# Altium schematic sheet Core.SchDoc: Title
size A3; Date: Date; CompanyName: Integrated Micro-Electronics Bulgaria; Organization: Design & Development Department; Address1: Drawing Type; Address2: Address 1; Address3: Address 2; Address4: Address 3; DocumentNumber: 730xxx; Revision: 01; SheetNumber: 1; SheetTotal: 1; PageSetup: Record=PageOptions|CenterHorizontal=True|CenterVertical=True|PrintScale=0.70|XCorrection=1.00|YCorrection=1.00|PrintKind=2|BorderSize=5000000|LeftOffset=0|BottomOffset=0|Orientation=2|PaperLength=1000|PaperWidth=1000|Scale=100|PaperSource=7|PrintQuality=-4|MediaType=1|DitherType=10|PaperKind=A4|PrintScaleMode=1; SheetSize: A3; Time: Time; ModifiedDate: Mod. Date
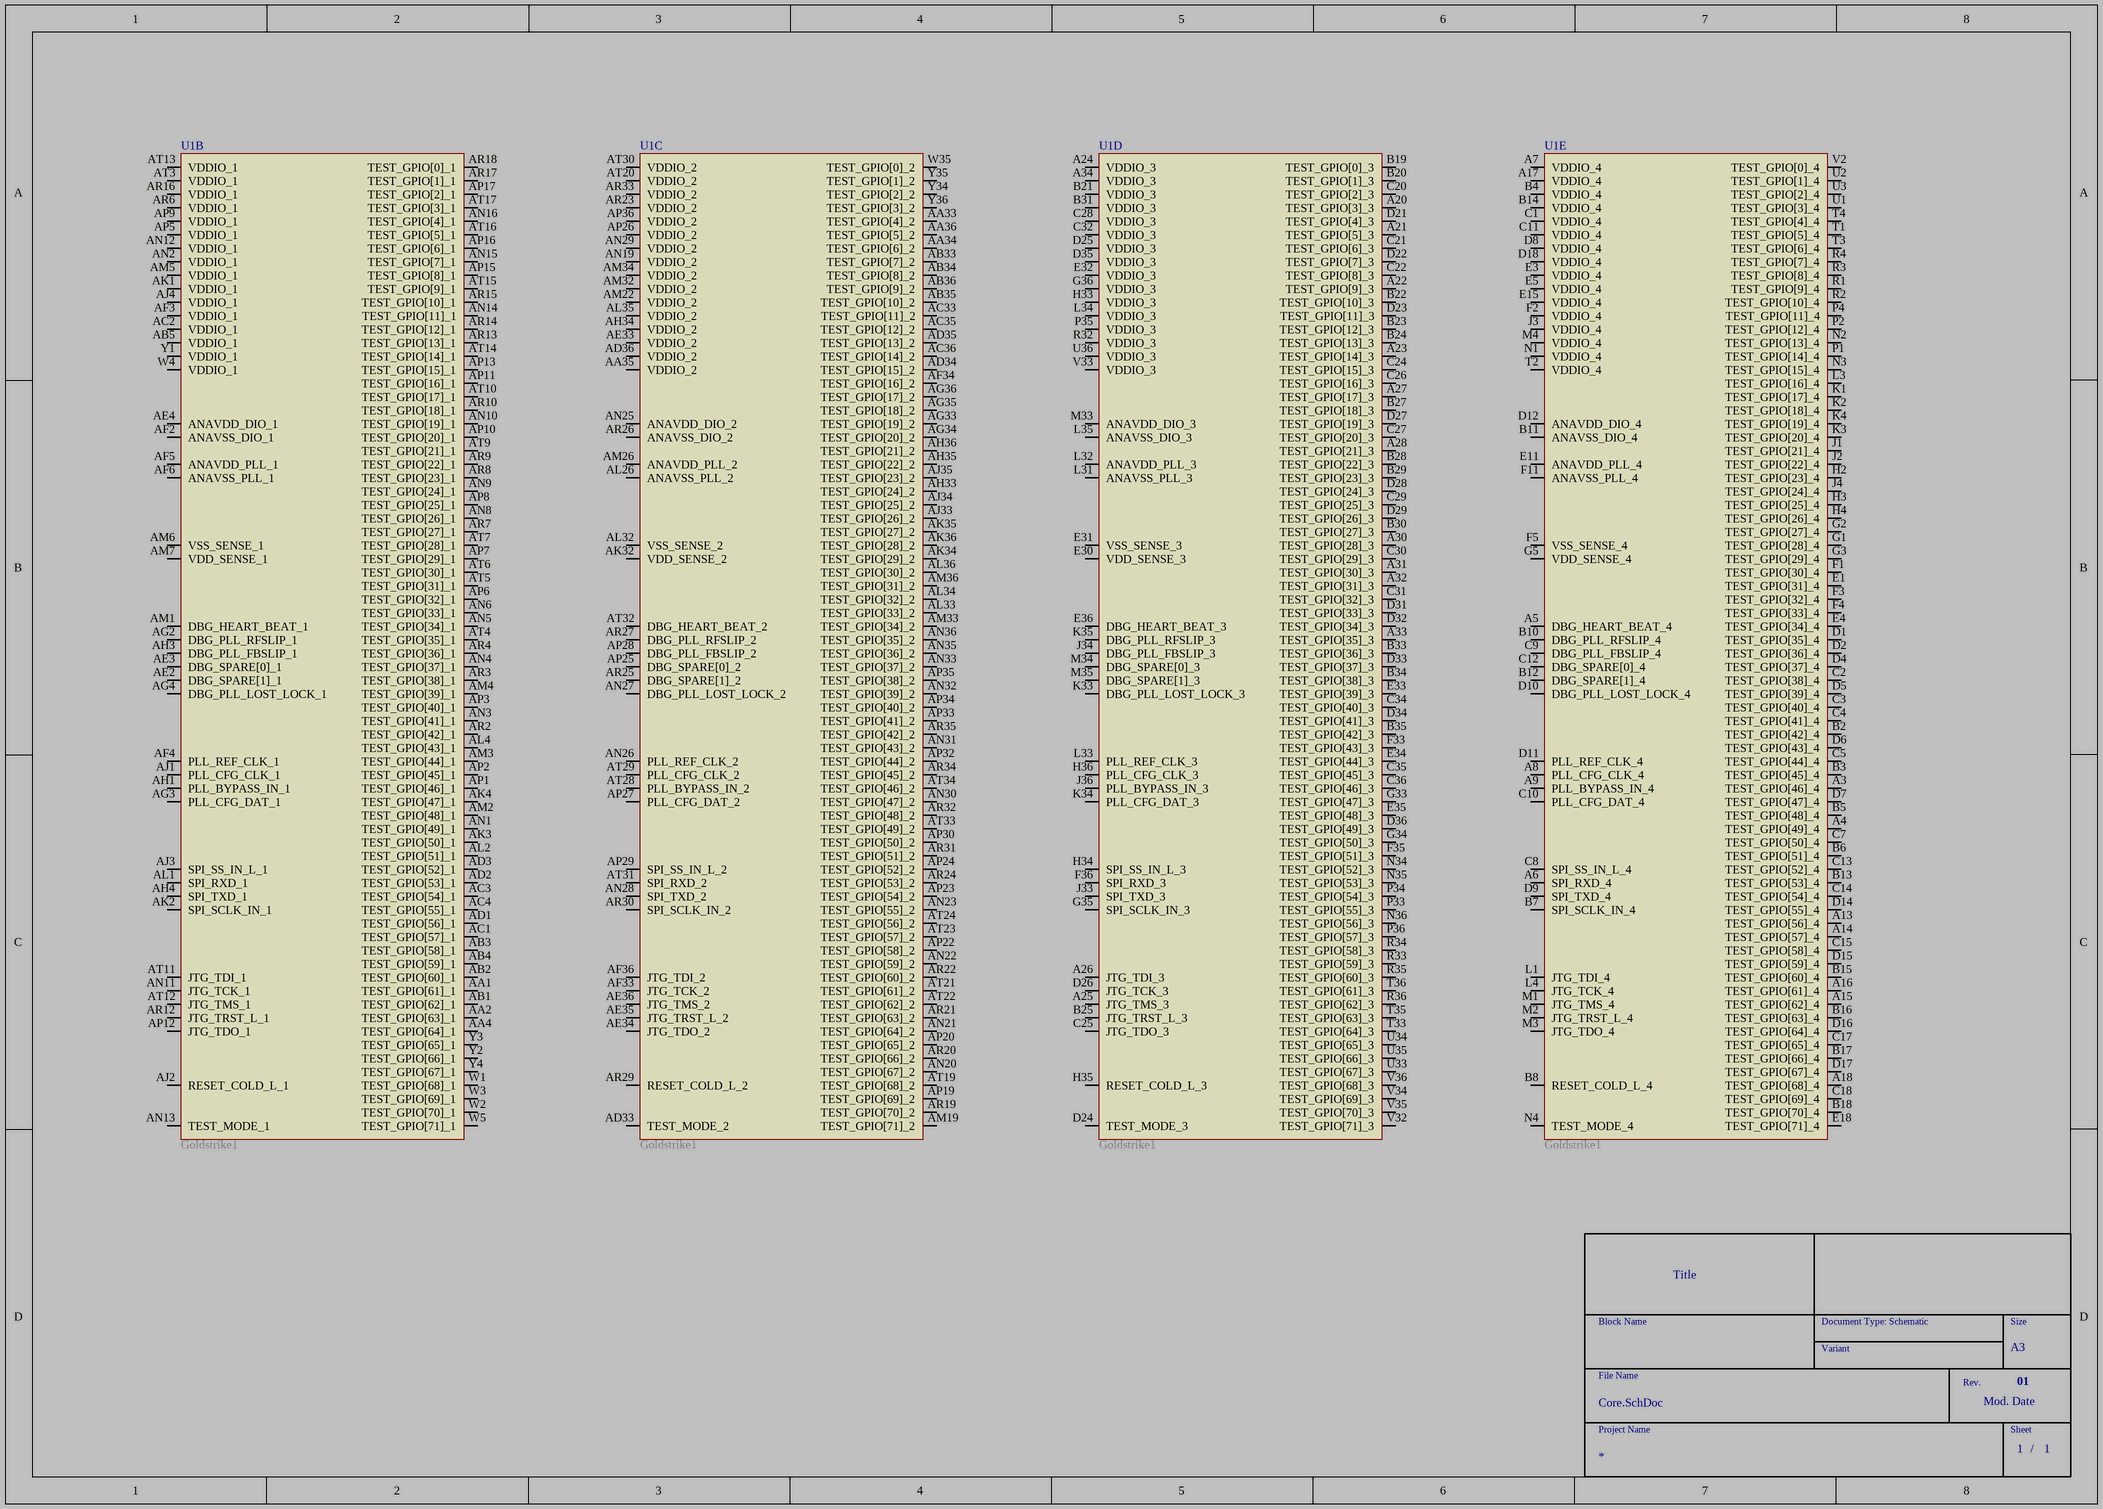
[diagram p0: Core.SchDoc]

## Parts
U1  Goldstrike1  (parts B,C,D,E of 5)

## Nets

Not connected (* = marked no-connect by the designer): U1 A3(TEST_GPIO[46]_4) A4(TEST_GPIO[49]_4) A5(DBG_HEART_BEAT_4) A6(SPI_RXD_4) A7(VDDIO_4) A8(PLL_CFG_CLK_4) A9(PLL_BYPASS_IN_4) A13(TEST_GPIO[56]_4) A14(TEST_GPIO[57]_4) A15(TEST_GPIO[62]_4) A16(TEST_GPIO[61]_4) A17(VDDIO_4) A18(TEST_GPIO[68]_4) A20(TEST_GPIO[3]_3) A21(TEST_GPIO[5]_3) A22(TEST_GPIO[9]_3) A23(TEST_GPIO[14]_3) A24(VDDIO_3) A25(JTG_TMS_3) A26(JTG_TDI_3) A27(TEST_GPIO[17]_3) A28(TEST_GPIO[21]_3) A30(TEST_GPIO[28]_3) A31(TEST_GPIO[30]_3) A32(TEST_GPIO[31]_3) A33(TEST_GPIO[35]_3) A34(VDDIO_3) AA1(TEST_GPIO[61]_1) AA2(TEST_GPIO[63]_1) AA4(TEST_GPIO[64]_1) AA33(TEST_GPIO[4]_2) AA34(TEST_GPIO[6]_2) AA35(VDDIO_2) AA36(TEST_GPIO[5]_2) AB1(TEST_GPIO[62]_1) AB2(TEST_GPIO[60]_1) AB3(TEST_GPIO[58]_1) AB4(TEST_GPIO[59]_1) AB5(VDDIO_1) AB33(TEST_GPIO[7]_2) AB34(TEST_GPIO[8]_2) AB35(TEST_GPIO[10]_2) AB36(TEST_GPIO[9]_2) AC1(TEST_GPIO[57]_1) AC2(VDDIO_1) AC3(TEST_GPIO[54]_1) AC4(TEST_GPIO[55]_1) AC33(TEST_GPIO[11]_2) AC35(TEST_GPIO[12]_2) AC36(TEST_GPIO[14]_2) AD1(TEST_GPIO[56]_1) AD2(TEST_GPIO[53]_1) AD3(TEST_GPIO[52]_1) AD33(TEST_MODE_2) AD34(TEST_GPIO[15]_2) AD35(TEST_GPIO[13]_2) AD36(VDDIO_2) AE2(DBG_SPARE[1]_1) AE3(DBG_SPARE[0]_1) AE4(ANAVDD_DIO_1) AE33(VDDIO_2) AE34(JTG_TDO_2) AE35(JTG_TRST_L_2) AE36(JTG_TMS_2) AF2(ANAVSS_DIO_1) AF3(VDDIO_1) AF4(PLL_REF_CLK_1) AF5(ANAVDD_PLL_1) AF6(ANAVSS_PLL_1) AF33(JTG_TCK_2) AF34(TEST_GPIO[16]_2) AF36(JTG_TDI_2) AG2(DBG_PLL_RFSLIP_1) AG3(PLL_CFG_DAT_1) AG4(DBG_PLL_LOST_LOCK_1) AG33(TEST_GPIO[19]_2) AG34(TEST_GPIO[20]_2) AG35(TEST_GPIO[18]_2) AG36(TEST_GPIO[17]_2) AH1(PLL_BYPASS_IN_1) AH3(DBG_PLL_FBSLIP_1) AH4(SPI_TXD_1) AH33(TEST_GPIO[24]_2) AH34(VDDIO_2) AH35(TEST_GPIO[22]_2) AH36(TEST_GPIO[21]_2) AJ1(PLL_CFG_CLK_1) AJ2(RESET_COLD_L_1) AJ3(SPI_SS_IN_L_1) AJ4(VDDIO_1) AJ33(TEST_GPIO[26]_2) AJ34(TEST_GPIO[25]_2) AJ35(TEST_GPIO[23]_2) AK1(VDDIO_1) AK2(SPI_SCLK_IN_1) AK3(TEST_GPIO[50]_1) AK4(TEST_GPIO[47]_1) AK32(VDD_SENSE_2) AK34(TEST_GPIO[29]_2) AK35(TEST_GPIO[27]_2) AK36(TEST_GPIO[28]_2) AL1(SPI_RXD_1) AL2(TEST_GPIO[51]_1) AL4(TEST_GPIO[43]_1) AL26(ANAVSS_PLL_2) AL32(VSS_SENSE_2) AL33(TEST_GPIO[33]_2) AL34(TEST_GPIO[32]_2) AL35(VDDIO_2) AL36(TEST_GPIO[30]_2) AM1(DBG_HEART_BEAT_1) AM2(TEST_GPIO[48]_1) AM3(TEST_GPIO[44]_1) AM4(TEST_GPIO[39]_1) AM5(VDDIO_1) AM6(VSS_SENSE_1) AM7(VDD_SENSE_1) AM19(TEST_GPIO[71]_2) AM22(VDDIO_2) AM26(ANAVDD_PLL_2) AM32(VDDIO_2) AM33(TEST_GPIO[34]_2) AM34(VDDIO_2) AM36(TEST_GPIO[31]_2) AN1(TEST_GPIO[49]_1) AN2(VDDIO_1) AN3(TEST_GPIO[41]_1) AN4(TEST_GPIO[37]_1) AN5(TEST_GPIO[34]_1) AN6(TEST_GPIO[33]_1) AN8(TEST_GPIO[26]_1) AN9(TEST_GPIO[24]_1) AN10(TEST_GPIO[19]_1) AN11(JTG_TCK_1) AN12(VDDIO_1) AN13(TEST_MODE_1) AN14(TEST_GPIO[11]_1) AN15(TEST_GPIO[7]_1) AN16(TEST_GPIO[4]_1) AN19(VDDIO_2) AN20(TEST_GPIO[67]_2) AN21(TEST_GPIO[64]_2) AN22(TEST_GPIO[59]_2) AN23(TEST_GPIO[55]_2) AN25(ANAVDD_DIO_2) AN26(PLL_REF_CLK_2) AN27(DBG_PLL_LOST_LOCK_2) AN28(SPI_TXD_2) AN29(VDDIO_2) AN30(TEST_GPIO[47]_2) AN31(TEST_GPIO[43]_2) AN32(TEST_GPIO[39]_2) AN33(TEST_GPIO[37]_2) AN35(TEST_GPIO[36]_2) AN36(TEST_GPIO[35]_2) AP1(TEST_GPIO[46]_1) AP2(TEST_GPIO[45]_1) AP3(TEST_GPIO[40]_1) AP5(VDDIO_1) AP6(TEST_GPIO[32]_1) AP7(TEST_GPIO[29]_1) AP8(TEST_GPIO[25]_1) AP9(VDDIO_1) AP10(TEST_GPIO[20]_1) AP11(TEST_GPIO[16]_1) AP12(JTG_TDO_1) AP13(TEST_GPIO[15]_1) AP15(TEST_GPIO[8]_1) AP16(TEST_GPIO[6]_1) AP17(TEST_GPIO[2]_1) AP19(TEST_GPIO[69]_2) AP20(TEST_GPIO[65]_2) AP22(TEST_GPIO[58]_2) AP23(TEST_GPIO[54]_2) AP24(TEST_GPIO[52]_2) AP25(DBG_SPARE[0]_2) AP26(VDDIO_2) AP27(PLL_CFG_DAT_2) AP28(DBG_PLL_FBSLIP_2) AP29(SPI_SS_IN_L_2) AP30(TEST_GPIO[50]_2) AP32(TEST_GPIO[44]_2) AP33(TEST_GPIO[41]_2) AP34(TEST_GPIO[40]_2) AP35(TEST_GPIO[38]_2) AP36(VDDIO_2) AR2(TEST_GPIO[42]_1) AR3(TEST_GPIO[38]_1) AR4(TEST_GPIO[36]_1) AR6(VDDIO_1) AR7(TEST_GPIO[27]_1) AR8(TEST_GPIO[23]_1) AR9(TEST_GPIO[22]_1) AR10(TEST_GPIO[18]_1) AR12(JTG_TRST_L_1) AR13(TEST_GPIO[13]_1) AR14(TEST_GPIO[12]_1) AR15(TEST_GPIO[10]_1) AR16(VDDIO_1) AR17(TEST_GPIO[1]_1) AR18(TEST_GPIO[0]_1) AR19(TEST_GPIO[70]_2) AR20(TEST_GPIO[66]_2) AR21(TEST_GPIO[63]_2) AR22(TEST_GPIO[60]_2) AR23(VDDIO_2) AR24(TEST_GPIO[53]_2) AR25(DBG_SPARE[1]_2) AR26(ANAVSS_DIO_2) AR27(DBG_PLL_RFSLIP_2) AR29(RESET_COLD_L_2) AR30(SPI_SCLK_IN_2) AR31(TEST_GPIO[51]_2) AR32(TEST_GPIO[48]_2) AR33(VDDIO_2) AR34(TEST_GPIO[45]_2) AR35(TEST_GPIO[42]_2) AT3(VDDIO_1) AT4(TEST_GPIO[35]_1) AT5(TEST_GPIO[31]_1) AT6(TEST_GPIO[30]_1) AT7(TEST_GPIO[28]_1) AT9(TEST_GPIO[21]_1) AT10(TEST_GPIO[17]_1) AT11(JTG_TDI_1) AT12(JTG_TMS_1) AT13(VDDIO_1) AT14(TEST_GPIO[14]_1) AT15(TEST_GPIO[9]_1) AT16(TEST_GPIO[5]_1) AT17(TEST_GPIO[3]_1) AT19(TEST_GPIO[68]_2) AT20(VDDIO_2) AT21(TEST_GPIO[61]_2) AT22(TEST_GPIO[62]_2) AT23(TEST_GPIO[57]_2) AT24(TEST_GPIO[56]_2) AT28(PLL_BYPASS_IN_2) AT29(PLL_CFG_CLK_2) AT30(VDDIO_2) AT31(SPI_RXD_2) AT32(DBG_HEART_BEAT_2) AT33(TEST_GPIO[49]_2) AT34(TEST_GPIO[46]_2) B2(TEST_GPIO[42]_4) B3(TEST_GPIO[45]_4) B4(VDDIO_4) B5(TEST_GPIO[48]_4) B6(TEST_GPIO[51]_4) B7(SPI_SCLK_IN_4) B8(RESET_COLD_L_4) B10(DBG_PLL_RFSLIP_4) B11(ANAVSS_DIO_4) B12(DBG_SPARE[1]_4) B13(TEST_GPIO[53]_4) B14(VDDIO_4) B15(TEST_GPIO[60]_4) B16(TEST_GPIO[63]_4) B17(TEST_GPIO[66]_4) B18(TEST_GPIO[70]_4) B19(TEST_GPIO[0]_3) B20(TEST_GPIO[1]_3) B21(VDDIO_3) B22(TEST_GPIO[10]_3) B23(TEST_GPIO[12]_3) B24(TEST_GPIO[13]_3) B25(JTG_TRST_L_3) B27(TEST_GPIO[18]_3) B28(TEST_GPIO[22]_3) B29(TEST_GPIO[23]_3) B30(TEST_GPIO[27]_3) B31(VDDIO_3) B33(TEST_GPIO[36]_3) B34(TEST_GPIO[38]_3) B35(TEST_GPIO[42]_3) C1(VDDIO_4) C2(TEST_GPIO[38]_4) C3(TEST_GPIO[40]_4) C4(TEST_GPIO[41]_4) C5(TEST_GPIO[44]_4) C7(TEST_GPIO[50]_4) C8(SPI_SS_IN_L_4) C9(DBG_PLL_FBSLIP_4) C10(PLL_CFG_DAT_4) C11(VDDIO_4) C12(DBG_SPARE[0]_4) C13(TEST_GPIO[52]_4) C14(TEST_GPIO[54]_4) C15(TEST_GPIO[58]_4) C17(TEST_GPIO[65]_4) C18(TEST_GPIO[69]_4) C20(TEST_GPIO[2]_3) C21(TEST_GPIO[6]_3) C22(TEST_GPIO[8]_3) C24(TEST_GPIO[15]_3) C25(JTG_TDO_3) C26(TEST_GPIO[16]_3) C27(TEST_GPIO[20]_3) C28(VDDIO_3) C29(TEST_GPIO[25]_3) C30(TEST_GPIO[29]_3) C31(TEST_GPIO[32]_3) C32(VDDIO_3) C34(TEST_GPIO[40]_3) C35(TEST_GPIO[45]_3) C36(TEST_GPIO[46]_3) D1(TEST_GPIO[35]_4) D2(TEST_GPIO[36]_4) D4(TEST_GPIO[37]_4) D5(TEST_GPIO[39]_4) D6(TEST_GPIO[43]_4) D7(TEST_GPIO[47]_4) D8(VDDIO_4) D9(SPI_TXD_4) D10(DBG_PLL_LOST_LOCK_4) D11(PLL_REF_CLK_4) D12(ANAVDD_DIO_4) D14(TEST_GPIO[55]_4) D15(TEST_GPIO[59]_4) D16(TEST_GPIO[64]_4) D17(TEST_GPIO[67]_4) D18(VDDIO_4) D21(TEST_GPIO[4]_3) D22(TEST_GPIO[7]_3) D23(TEST_GPIO[11]_3) D24(TEST_MODE_3) D25(VDDIO_3) D26(JTG_TCK_3) D27(TEST_GPIO[19]_3) D28(TEST_GPIO[24]_3) D29(TEST_GPIO[26]_3) D31(TEST_GPIO[33]_3) D32(TEST_GPIO[34]_3) D33(TEST_GPIO[37]_3) D34(TEST_GPIO[41]_3) D35(VDDIO_3) D36(TEST_GPIO[49]_3) E1(TEST_GPIO[31]_4) E3(VDDIO_4) E4(TEST_GPIO[34]_4) E5(VDDIO_4) E11(ANAVDD_PLL_4) E15(VDDIO_4) E18(TEST_GPIO[71]_4) E30(VDD_SENSE_3) E31(VSS_SENSE_3) E32(VDDIO_3) E33(TEST_GPIO[39]_3) E34(TEST_GPIO[44]_3) E35(TEST_GPIO[48]_3) E36(DBG_HEART_BEAT_3) F1(TEST_GPIO[30]_4) F2(VDDIO_4) F3(TEST_GPIO[32]_4) F4(TEST_GPIO[33]_4) F5(VSS_SENSE_4) F11(ANAVSS_PLL_4) F33(TEST_GPIO[43]_3) F35(TEST_GPIO[51]_3) F36(SPI_RXD_3) G1(TEST_GPIO[28]_4) G2(TEST_GPIO[27]_4) G3(TEST_GPIO[29]_4) G5(VDD_SENSE_4) G33(TEST_GPIO[47]_3) G34(TEST_GPIO[50]_3) G35(SPI_SCLK_IN_3) G36(VDDIO_3) H2(TEST_GPIO[23]_4) H3(TEST_GPIO[25]_4) H4(TEST_GPIO[26]_4) H33(VDDIO_3) H34(SPI_SS_IN_L_3) H35(RESET_COLD_L_3) H36(PLL_CFG_CLK_3) J1(TEST_GPIO[21]_4) J2(TEST_GPIO[22]_4) J3(VDDIO_4) J4(TEST_GPIO[24]_4) J33(SPI_TXD_3) J34(DBG_PLL_FBSLIP_3) J36(PLL_BYPASS_IN_3) K1(TEST_GPIO[17]_4) K2(TEST_GPIO[18]_4) K3(TEST_GPIO[20]_4) K4(TEST_GPIO[19]_4) K33(DBG_PLL_LOST_LOCK_3) K34(PLL_CFG_DAT_3) K35(DBG_PLL_RFSLIP_3) L1(JTG_TDI_4) L3(TEST_GPIO[16]_4) L4(JTG_TCK_4) L31(ANAVSS_PLL_3) L32(ANAVDD_PLL_3) L33(PLL_REF_CLK_3) L34(VDDIO_3) L35(ANAVSS_DIO_3) M1(JTG_TMS_4) M2(JTG_TRST_L_4) M3(JTG_TDO_4) M4(VDDIO_4) M33(ANAVDD_DIO_3) M34(DBG_SPARE[0]_3) M35(DBG_SPARE[1]_3) N1(VDDIO_4) N2(TEST_GPIO[13]_4) N3(TEST_GPIO[15]_4) N4(TEST_MODE_4) N34(TEST_GPIO[52]_3) N35(TEST_GPIO[53]_3) N36(TEST_GPIO[56]_3) P1(TEST_GPIO[14]_4) P2(TEST_GPIO[12]_4) P4(TEST_GPIO[11]_4) P33(TEST_GPIO[55]_3) P34(TEST_GPIO[54]_3) P35(VDDIO_3) P36(TEST_GPIO[57]_3) R1(TEST_GPIO[9]_4) R2(TEST_GPIO[10]_4) R3(TEST_GPIO[8]_4) R4(TEST_GPIO[7]_4) R32(VDDIO_3) R33(TEST_GPIO[59]_3) R34(TEST_GPIO[58]_3) R35(TEST_GPIO[60]_3) R36(TEST_GPIO[62]_3) T1(TEST_GPIO[5]_4) T2(VDDIO_4) T3(TEST_GPIO[6]_4) T4(TEST_GPIO[4]_4) T33(TEST_GPIO[64]_3) T35(TEST_GPIO[63]_3) T36(TEST_GPIO[61]_3) U1(TEST_GPIO[3]_4) U2(TEST_GPIO[1]_4) U3(TEST_GPIO[2]_4) U33(TEST_GPIO[67]_3) U34(TEST_GPIO[65]_3) U35(TEST_GPIO[66]_3) U36(VDDIO_3) V2(TEST_GPIO[0]_4) V32(TEST_GPIO[71]_3) V33(VDDIO_3) V34(TEST_GPIO[69]_3) V35(TEST_GPIO[70]_3) V36(TEST_GPIO[68]_3) W1(TEST_GPIO[68]_1) W2(TEST_GPIO[70]_1) W3(TEST_GPIO[69]_1) W4(VDDIO_1) W5(TEST_GPIO[71]_1) W35(TEST_GPIO[0]_2) Y1(VDDIO_1) Y2(TEST_GPIO[66]_1) Y3(TEST_GPIO[65]_1) Y4(TEST_GPIO[67]_1) Y34(TEST_GPIO[2]_2) Y35(TEST_GPIO[1]_2) Y36(TEST_GPIO[3]_2)

## Notes on the sheet
- Block Name
- Document Type: Schematic
- Size
- File Name
- Variant
- Rev.
- Project Name
- Sheet
- /